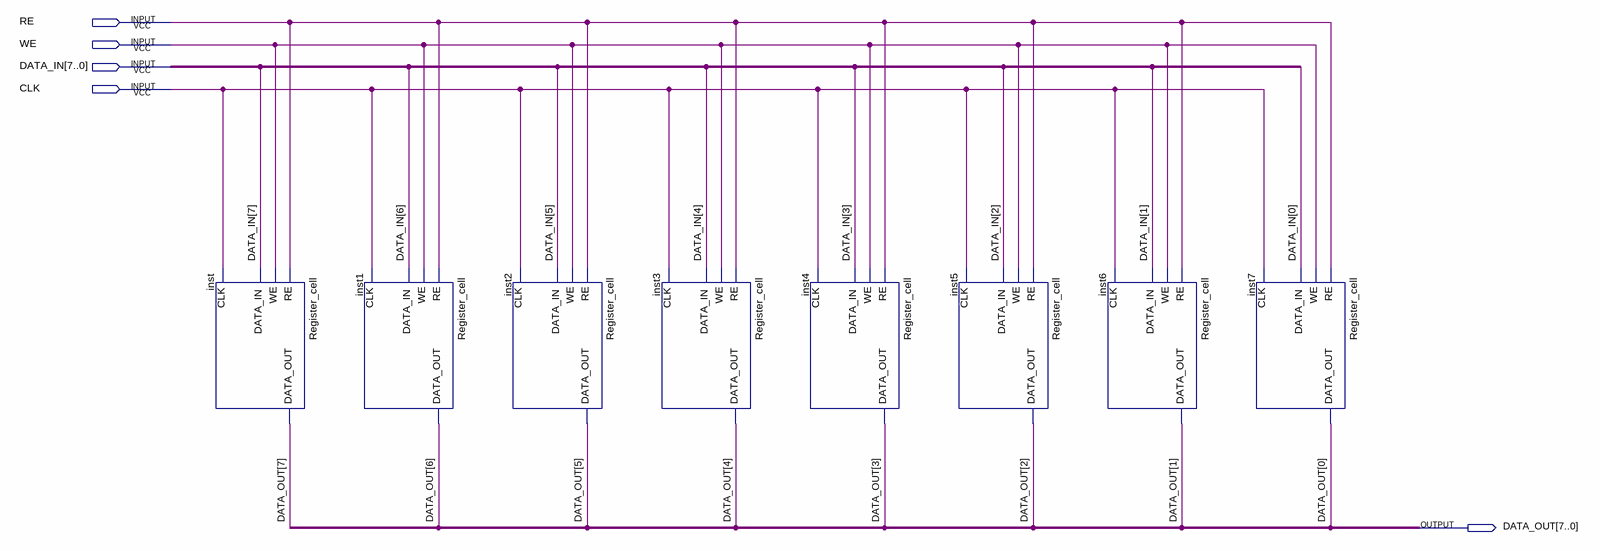
[diagram p0: schematic sheet]
// Quartus schematic Register.bdf as structural Verilog: 8 symbols, 5 pins
module Register (
  input  RE,
  input  WE,
  input  [7:0] DATA_IN,
  input  CLK,
  output [7:0] DATA_OUT
);

  Register_cell inst (.RE(RE), .WE(WE), .DATA_IN(DATA_IN[7]), .CLK(CLK), .DATA_OUT(DATA_OUT[7]));
  Register_cell inst1 (.RE(RE), .WE(WE), .DATA_IN(DATA_IN[6]), .CLK(CLK), .DATA_OUT(DATA_OUT[6]));
  Register_cell inst2 (.RE(RE), .WE(WE), .DATA_IN(DATA_IN[5]), .CLK(CLK), .DATA_OUT(DATA_OUT[5]));
  Register_cell inst3 (.RE(RE), .WE(WE), .DATA_IN(DATA_IN[4]), .CLK(CLK), .DATA_OUT(DATA_OUT[4]));
  Register_cell inst4 (.RE(RE), .WE(WE), .DATA_IN(DATA_IN[3]), .CLK(CLK), .DATA_OUT(DATA_OUT[3]));
  Register_cell inst5 (.RE(RE), .WE(WE), .DATA_IN(DATA_IN[2]), .CLK(CLK), .DATA_OUT(DATA_OUT[2]));
  Register_cell inst6 (.RE(RE), .WE(WE), .DATA_IN(DATA_IN[1]), .CLK(CLK), .DATA_OUT(DATA_OUT[1]));
  Register_cell inst7 (.RE(RE), .WE(WE), .DATA_IN(DATA_IN[0]), .CLK(CLK), .DATA_OUT(DATA_OUT[0]));
endmodule
